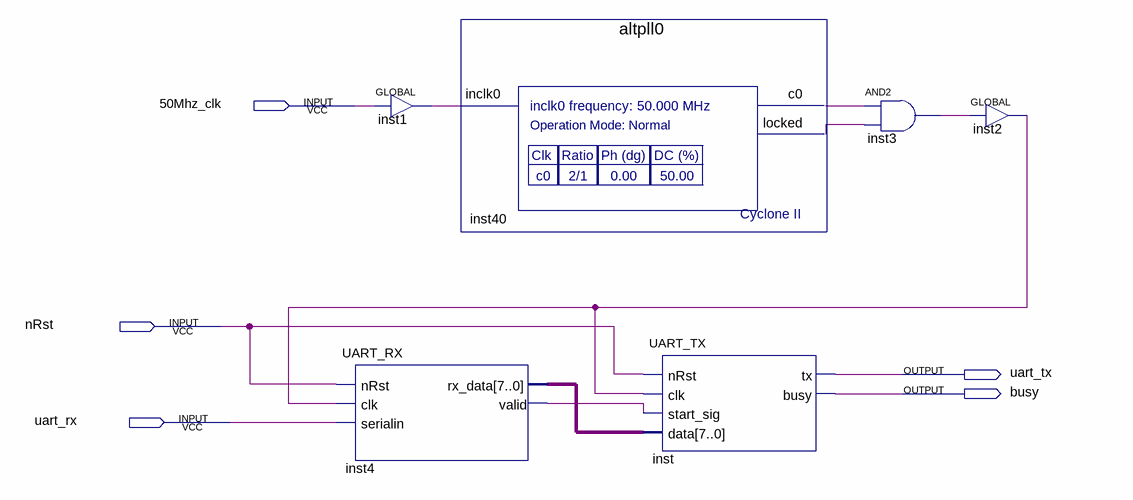
[diagram p0: schematic sheet]
// Quartus schematic UART_Echoback.bdf as structural Verilog: 6 symbols, 5 pins
module UART_Echoback (
  input  \50Mhz_clk ,
  input  nRst,
  input  uart_rx,
  output uart_tx,
  output busy
);

  wire inst1_out, inst2_out, inst3_out, inst4_valid, inst40_c0, inst40_locked;
  wire [7:0] inst4_rx_data;

  UART_RX inst4 (.nRst(nRst), .clk(inst2_out), .serialin(uart_rx), .rx_data(inst4_rx_data), .valid(inst4_valid));
  GLOBAL inst1 (.IN(\50Mhz_clk ), .OUT(inst1_out));
  altpll0 inst40 (.inclk0(inst1_out), .c0(inst40_c0), .locked(inst40_locked));
  UART_TX inst (.nRst(nRst), .clk(inst2_out), .start_sig(inst4_valid), .data(inst4_rx_data), .tx(uart_tx), .busy(busy));
  and inst3 (inst3_out, inst40_c0, inst40_locked);
  GLOBAL inst2 (.IN(inst3_out), .OUT(inst2_out));
endmodule
